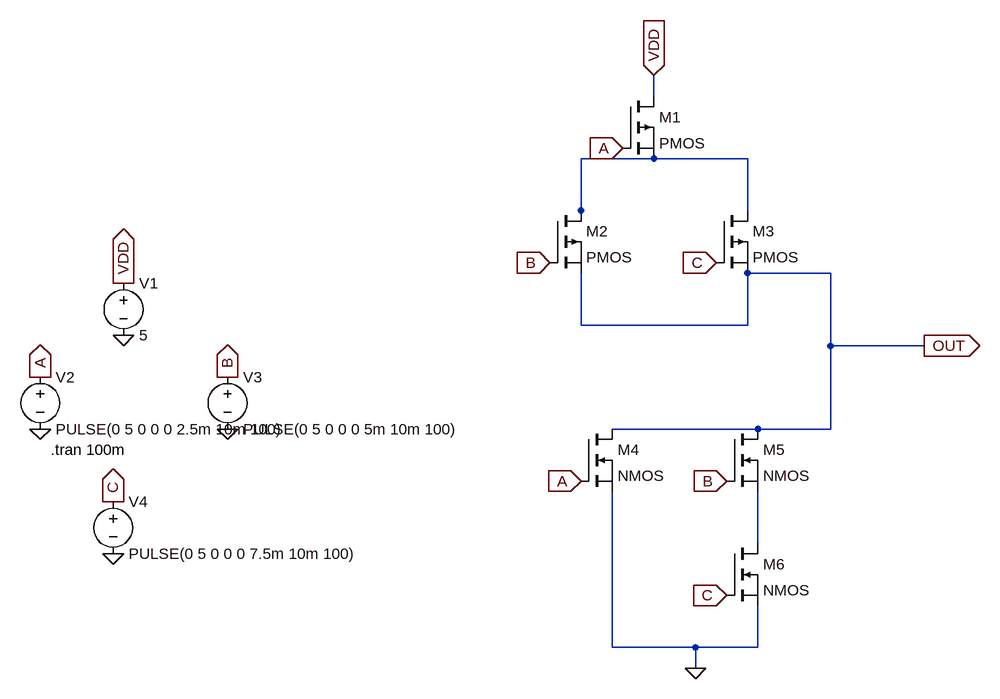
[diagram p0: schematic ~A+BC.asc]
~A+BC.asc, the LTspice schematic file:
Version 4
SHEET 1 1372 680
WIRE 848 -272 848 -304
WIRE 848 -176 736 -176
WIRE 992 -176 848 -176
WIRE 736 -96 736 -176
WIRE 992 -96 992 -176
WIRE 736 -80 736 -96
WIRE 1120 0 992 0
WIRE 736 80 736 0
WIRE 992 80 992 0
WIRE 992 80 736 80
WIRE 1120 112 1120 0
WIRE 1264 112 1120 112
WIRE 1008 240 784 240
WIRE 1120 240 1120 112
WIRE 1120 240 1008 240
WIRE 1008 416 1008 336
WIRE 784 576 784 336
WIRE 912 576 784 576
WIRE 1008 576 1008 512
WIRE 1008 576 912 576
WIRE 912 608 912 576
FLAG 192 240 0
FLAG 16 432 0
FLAG -96 240 0
FLAG 32 96 0
FLAG 32 16 VDD
IOPIN 32 16 Out
FLAG -96 160 A
IOPIN -96 160 Out
FLAG 192 160 B
IOPIN 192 160 Out
FLAG 16 352 C
IOPIN 16 352 Out
FLAG 912 608 0
FLAG 848 -304 VDD
IOPIN 848 -304 In
FLAG 800 -192 A
IOPIN 800 -192 In
FLAG 688 -16 B
IOPIN 688 -16 In
FLAG 960 320 B
IOPIN 960 320 In
FLAG 944 -16 C
IOPIN 944 -16 In
FLAG 960 496 C
IOPIN 960 496 In
FLAG 736 320 A
IOPIN 736 320 In
FLAG 1264 112 OUT
IOPIN 1264 112 Out
SYMBOL voltage 32 0 R0
WINDOW 123 0 0 Left 0
WINDOW 39 0 0 Left 0
SYMATTR InstName V1
SYMATTR Value 5
SYMBOL voltage -96 144 R0
WINDOW 123 0 0 Left 0
WINDOW 39 0 0 Left 0
SYMATTR InstName V2
SYMATTR Value PULSE(0 5 0 0 0 2.5m 10m 100)
SYMBOL voltage 192 144 R0
WINDOW 123 0 0 Left 0
WINDOW 39 0 0 Left 0
SYMATTR InstName V3
SYMATTR Value PULSE(0 5 0 0 0 5m 10m 100)
SYMBOL voltage 16 336 R0
WINDOW 123 0 0 Left 0
WINDOW 39 0 0 Left 0
SYMATTR InstName V4
SYMATTR Value PULSE(0 5 0 0 0 7.5m 10m 100)
SYMBOL pmos 800 -272 R0
SYMATTR InstName M1
SYMBOL pmos 688 -96 R0
SYMATTR InstName M2
SYMBOL pmos 944 -96 R0
SYMATTR InstName M3
SYMBOL nmos 736 240 R0
SYMATTR InstName M4
SYMBOL nmos 960 240 R0
SYMATTR InstName M5
SYMBOL nmos 960 416 R0
SYMATTR InstName M6
TEXT -80 272 Left 2 !.tran 100m

The netlist it stands for:
* ~A+BC.asc
V1 VDD 0 5
V2 A 0 PULSE(0 5 0 0 0 2.5m 10m 100)
V3 B 0 PULSE(0 5 0 0 0 5m 10m 100)
V4 C 0 PULSE(0 5 0 0 0 7.5m 10m 100)
M1 VDD A N001 N001 PMOS
M2 N001 B OUT OUT PMOS
M3 N001 C OUT OUT PMOS
M4 OUT A 0 0 NMOS
M5 OUT B N002 N002 NMOS
M6 N002 C 0 0 NMOS
.model NMOS NMOS
.model PMOS PMOS
.lib standard.mos
.tran 100m
.backanno
.end